# Altium schematic sheet Power.SchDoc: Power
size A4; Organization: Use Organization_Name in ProjParam; Address1: Eliot Ferragni; Address2: STI-MOBOTS; Address3: EPFL; Address4: CH-1015 LAUSANNE; DocumentNumber: 4; Revision: A; SheetNumber: 4; SheetTotal: 7; ApprovedBy: Init ApprovedBy in DocParam; CheckedBy: Init CheckedBy in DocParam; Author: Init Author in DocParam; CompanyName: Init CompanyName in DocParam; DrawnBy: Init DrawBy in DocParam; Engineer: Init Engineer in DocParam; DocumentName: Init DocumentName in DocParam; ProjectName: Init ProjectName in DocParam
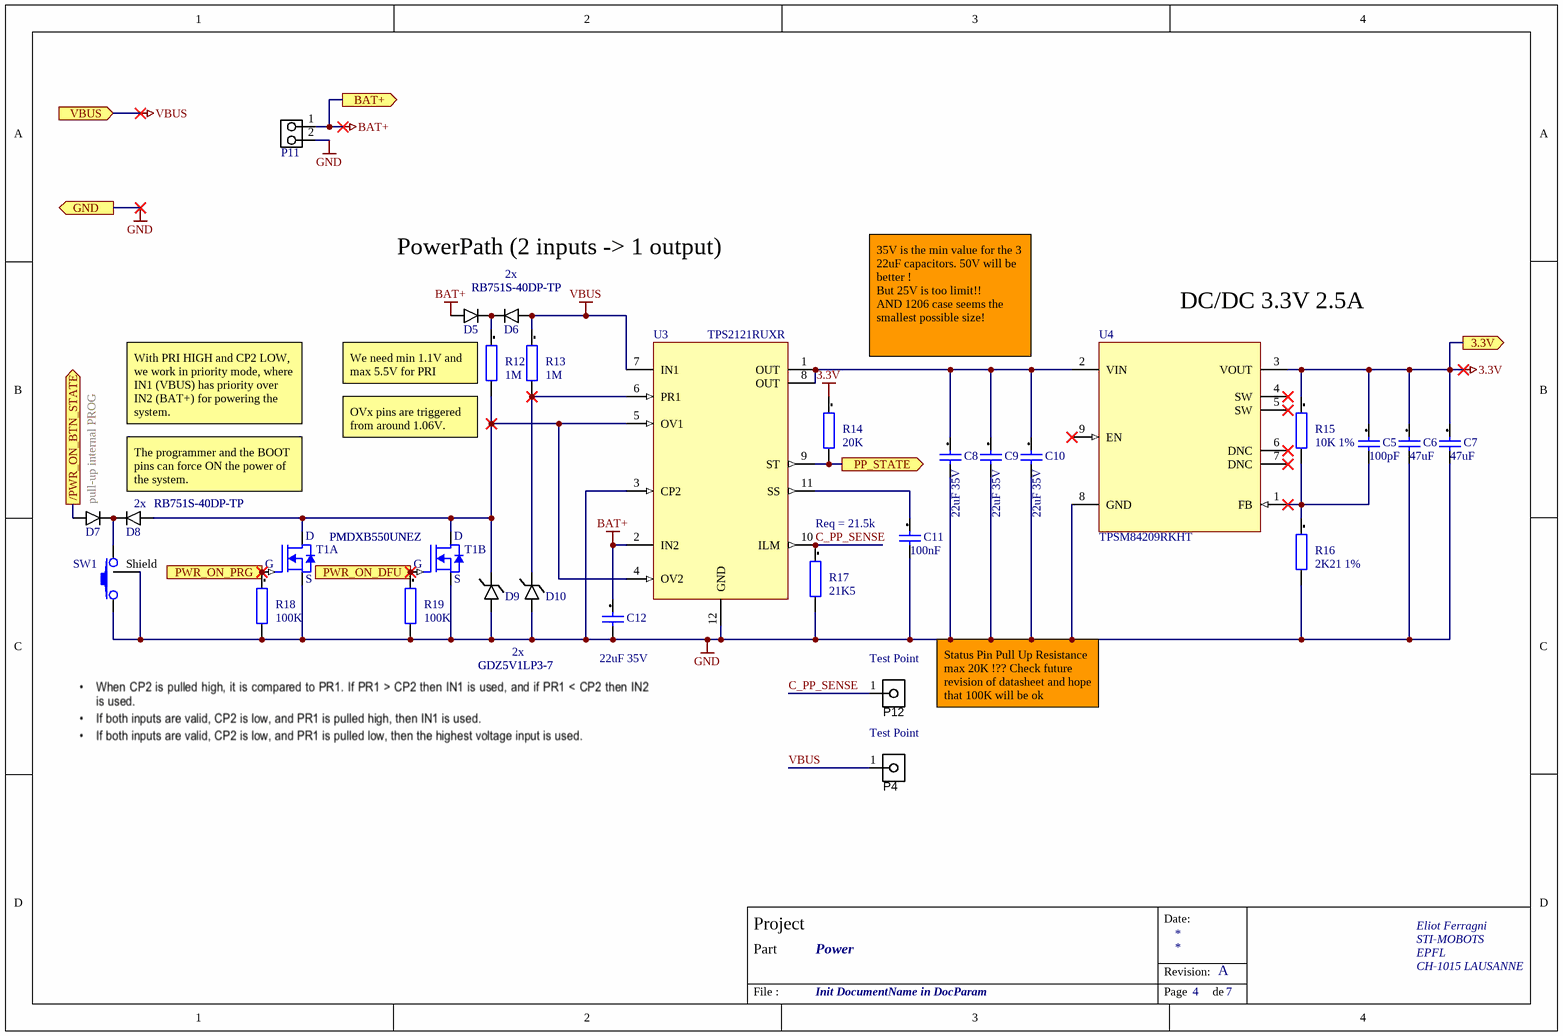
[diagram p0: Power.SchDoc]

## Parts
C5  100pF  [CAPC1608X08L]
C6  47uF  [CAPC1608X08L]
C7  47uF  [CAPC1608X08L]
C8  22uF 35V  [CAPC3216X17L]
C9  22uF 35V  [CAPC3216X17L]
C10  22uF 35V  [CAPC3216X17L]
C11  100nF  [CAPC1608X08L]
C12  22uF 35V  [CAPC3216X17L]
D5  RB751S-40DP-TP  [0201 diode - Wide]
D6  RB751S-40DP-TP  [0201 diode - Wide]
D7  RB751S-40DP-TP  [0201 diode - Wide]
D8  RB751S-40DP-TP  [0201 diode - Wide]
D9  GDZ5V1LP3-7  [0201 diode - Wide]
D10  GDZ5V1LP3-7  [0201 diode - Wide]
P4  Header 1  [HEADER1x1-2.54]  (value not drawn)
P11  2 power pads  [PowerPads 2 pins]  (value not drawn)
P12  Header 1  [HEADER1x1-2.54]  (value not drawn)
R12  1M  [RESC1608X06N]
R13  1M  [RESC1608X06N]
R14  20K  [RESC1608X06N]
R15  10K 1%  [RESC1608X06N]
R16  2K21 1%  [RESC1608X06N]
R17  21K5  [RESC1608X06N]
R18  100K  [RESC1608X06N]
R19  100K  [RESC1608X06N]
SW1  button  [C&K_KMR2]  (value not drawn)
T1  PMDXB550UNEZ  [DFN1010B-6]  (parts A,B of 2)
U3  TPS2121RUXR  [VQFN-HR (RUX) 12]
U4  TPSM84209RKHT  [QFN-FCMOD (RKH) 9]

## Ports
3.3V (out), /PWR_ON_BTN_STATE (out), BAT+ (out), GND (out), PP_STATE (out), PWR_ON_DFU (in), PWR_ON_PRG (in), VBUS (in)

## Nets
3.3V: C5.1 C6.1 C7.1 R14.1 R15.1 U4.3(VOUT) ; port 3.3V
BAT+: C12.1 D5.2(C) P11.1 U3.2(IN2) ; port BAT+
GND: C6.2 C7.2 C8.2 C9.2 C10.2 C11.2 C12.2 D9.2(C) D10.2(C) P11.2 R16.2 R17.2 R18.2 R19.2 SW1.1 SW1.Shield T1.1(S) T1.4(S) U3.3(CP2) U3.12(GND) U4.8(GND) ; port GND
VBUS: D6.2(C) P4.1 R13.1 U3.7(IN1) ; port VBUS
/PWR_ON_BTN_STATE: D7.2(C) ; port /PWR_ON_BTN_STATE
C_PP_SENSE: P12.1 R17.1 U3.10(ILM)
PP_STATE: R14.2 U3.9(ST) ; port PP_STATE
PWR_ON_DFU: R19.1 T1.5(G) ; port PWR_ON_DFU
PWR_ON_PRG: R18.1 T1.2(G) ; port PWR_ON_PRG
NetC5_2: C5.2 R15.2 R16.1 U4.1(FB)
NetC8_1: C8.1 C9.1 C10.1 U3.1(OUT) U3.8(OUT) U4.2(VIN)
NetC11_1: C11.1 U3.11(SS)
NetD5_1: D5.1(C) D6.1(C) R12.1
NetD7_1: D7.1(C) D8.1(C) SW1.2
NetD8_2: D8.2(C) D9.1(C) R12.2 T1.3(D) T1.6(D) U3.4(OV2) U3.5(OV1)
NetD10_1: D10.1(C) R13.2 U3.6(PR1)

Not connected (* = marked no-connect by the designer): U4 4(SW)* 5(SW)* 6(DNC)* 7(DNC)* 9(EN)*

## Notes on the sheet
- PowerPath (2 inputs -> 1 output)
- 2x
- DC/DC 3.3V 2.5A
- (near R12) We need min 1.1V and max 5.5V for PRI
- 35V is the min value for the 3 22uF capacitors. 50V will be better !
  But 25V is too limit!!
  AND 1206 case seems the smallest possible size!
- With PRI HIGH and CP2 LOW, we work in priority mode, where IN1 (VBUS) has priority over IN2 (BAT+) for powering the system.
- (near R12) OVx pins are triggered from around 1.06V.
- (near D7) pull-up internal PROG
- The programmer and the BOOT pins can force ON the power of the system.
- (near D8) 2x
- Req = 21.5k
- (near P12) Test Point
- (near P12) Status Pin Pull Up Resistance max 20K !?? Check future revision of datasheet and hope that 100K will be ok
- Test Point
- Date:
- Project
- Part
- Revision:
- File :
- Page
- de

## Library data of the parts
C5-C7 C11 = TBD Capacitor[[/\]]0603[[/\]]1: Capacitor TBD 0603; Preference: 1; Currentie: CHF; Size: 0603; Footprint Acort: 0603_G; ROHS: True; DateLastUpdate: 2012-11-19 / 14:36:40
C8-C10 C12 = TBD Capacitor[[/\]]1206[[/\]]1: Capacitor TBD 1206; Preference: 1; Currentie: CHF; Size: 1206; Footprint Acort: 1206; ROHS: True; DateLastUpdate: 2012-11-19 / 14:37:26
D5-D8 = RB751S-40DP-TP: Schottky Diodes & Rectifiers 203 Package Schottky Diodes; Manufacturer: MCC; Reverse Voltage (DC): 28V; Average Rectified Current: 30mA; Element Configuration: Single; Forward Current: 200mA; Max Repetitive Reverse Voltage (Vrrm): 40V; Peak Reverse Current: 500nA; Max Power Dissipation: 100mW; Supplier 1: Digi-Key; Manufacturer Part Number: RB751S-40DP-TP; Stock 1: 104704; Pricing 1: 1=0.3, 10=0.27, 100=0.1514, 500=0.08112, 1000=0.05516 (USD); Mount: Surface Mount; Case/Package: 0201; Case Code (Metric): 0603; Case Code (Imperial): 0201; Max Operating Temperature: 125°C; Packaging: Tape and Reel; Termination: SMD/SMT; Max Forward Surge Current (Ifsm): 200mA; Package Quantity: 10000; Max Reverse Voltage (DC): 40V; Length: 0.67mm; Height: 0.34mm; Width: 0.37mm; Supplier Part Number 1: RB751S-40DP-TPMSCT-ND
D9 D10 = GDZ5V1LP3-7: DIODE ZENER 5.1V 250MW 2DFN; Manufacturer: Diodes; Tolerance: 5%; Max Reverse Leakage Current: 200nA; Element Configuration: Single; Supplier 1: Digi-Key; Manufacturer Part Number: GDZ5V1LP3-7; Stock 1: 50190; Pricing 1: 1=0.37, 10=0.303, 100=0.1607, 500=0.1057, 1000=0.07188 (USD); Mount: Surface Mount; Case/Package: DFN; Number of Pins: 2; Min Operating Temperature: -55°C; Max Operating Temperature: 150°C; Packaging: Tape and Reel; Max Power Dissipation: 250mW; Package Quantity: 10000; Zener Voltage: 5.1V; Zener Current: 200nA; Voltage Tolerance: 5%; Peak Reverse Current: 200nA; Power Rating: 250mW; Length: 0.62mm; Height: 0.3mm; Width: 0.32mm; Radiation Hardening: No; REACH SVHC: No SVHC; ComponentLink1URL: https://www.diodes.com/assets/Datasheets/GDZxVxLP3.pdf; ComponentLink1Description: https://www.diodes.com/assets/Datasheets/GDZxVxLP3.pdf; Supplier Part Number 1: GDZ5V1LP3-7DICT-ND
P11 = 2 power pads: 2-Pin; Manufacturer: Generic Components; Class I: Connector; Revision: July-2002: Re-released for DXP Platform.; Publisher: Altium Limited
R12-R19 = TBD[[/\]]0603[[/\]]1: Resistor ToDo 0603; Preference: 1; Currentie: CHF; Size: 0603; Footprint Acort: 0603; ROHS: True; DateLastUpdate: 2012-11-19 / 14:13:33
SW1 = C&K KMR2: KMR221GLFS; Manufacturer: Tyco; Manufacturer Nr: 7-188275-6; Preference: 1; Currentie: CHF; Quant_1: 10; Quant_2: 900; Circuit: SPST-NO; Switch Function: Off-Mom; Contact Rating @ Voltage: 0.05A @ 32VDC; Actuator Type: Standard; Actuator Height off PCB, from Pins: 1.90mm; Actuator Orientation: Top Actuated; Outline: 4.60mm x 2.80mm; Illumination: Non-Illuminated; Operating Force: 200gf; Switch Travel: 0.25mm; Mechanical Life: 200,000 Cycles; Footprint Acort: ToDefine; ComponentLink1Description: Datasheet; ComponentLink1URL: http://ecommas.tycoelectronics.com/commerce/DocumentDelivery/DDEController?Action=showdoc&DocId=Customer+Drawing%7F188275%7FR%7Fpdf%7FEnglish%7FC_188275_R.pdf; Supplier: Farnell; Supplier Nr: 1056234; ComponentLink2Description: Farnell link; ComponentLink2URL: http://fr.farnell.com/jsp/displayProduct.jsp?sku=1056234; ROHS: True; Type: SMD; Orientation: Vertical; DateLastUpdate: 2007-12-04 / 09:15:57; Price_1: 1,1; Price_2: 0,924; Supplier 1: Digi-Key; Manufacturer Part Number: KMR221GLFS; Category: Switches; Stock 1: 20549; Pricing 1: 1=0.51, 10=0.493, 25=0.484, 50=0.4656, 100=0.4017, 250=0.3652, 500=0.34694, 1000=0.2739 (USD); Packaging: Cut Tape (CT); Mounting Type: Surface Mount; Termination Style: Gull Wing; Illumination Voltage (Nominal): -; Illumination Type, Color: -; Ingress Protection: -; Features: Grounding Pin; Actuator Material: -; Operating Temperature: -40°C ~ 85°C; ComponentLink3URL: http://www.ck-components.com/index.php?module=media&action=Display&cmpref=14414&lang=en&width=&height=&format=&alt=; ComponentLink3Description: http://www.ck-components.com/index.php?module=media&action=Display&cmpref=14414&lang=en&width=&height=&format=&alt=; Supplier Part Number 1: 401-1427-1-ND
T1 = PMDXB550UNEZ: DUAL N-CHANNEL 30V; Manufacturer: NXP Semiconductors; Continuous Drain Current (ID): 590mA; Max Power Dissipation: 285mW; Rds On Max: 670mR; Input Capacitance: 30.3pF; FET Type: 2 N-Channel; Supplier 1: Digi-Key; Stock 1: 5582; Pricing 1: 1=0.48, 10=0.379, 100=0.2601, 500=0.17838, 1000=0.13379 (USD); Mount: Surface Mount; Min Operating Temperature: -55°C; Max Operating Temperature: 150°C; Drain to Source Voltage (Vdss): 30V; Packaging: Tape and Reel; Supplier Part Number 1: 1727-2277-1-ND; Manufacturer Part Number: PMDXB550UNEZ
U3 = TPS2121RUXR: Power Mux Dual Input One Output; Manufacturer: Texas Instruments; PartNumber: TPS2121RUXR; RefDes: RefDes; Type: DEV; Value: Value
U4 = TPSM84209RKHT: DC DC CONVERTER 1.2-6V 15W; Manufacturer: Texas Instruments; Voltage - Input (Min): 4.5V; Voltage - Input (Max): 28V; Voltage - Output 1: 1.2 ~ 6 V; Current - Output (Max): 2.5A; Efficiency: 86.5%; Supplier 1: Digi-Key; Manufacturer Part Number: TPSM84209RKHT; RoHS: Request Inventory Verification; Category: Power Supplies - Board Mount; Stock 1: 47; Pricing 1: 1=5.04, 10=4.53, 100=3.7117 (USD); Packaging: Cut Tape (CT); Part Status: Active; Type: Non-Isolated PoL Module; Voltage - Output 2: -; Voltage - Output 3: -; Voltage - Output 4: -; Applications: ITE (Commercial); Features: OCP, OTP, UVLO; Operating Temperature: -40°C ~ 85°C (With Derating); Mounting Type: Surface Mount; Package / Case: 9-PowerQFN; Size / Dimension: 0.18" L x 0.16" W x 0.08" H (4.5mm x 4.0mm x 2.1mm); Supplier Device Package: 9-QFN-FCMOD (4.5x4); ComponentLink1URL: http://www.ti.com/lit/ds/symlink/tpsm84209.pdf; ComponentLink1Description: http://www.ti.com/lit/ds/symlink/tpsm84209.pdf
P4 P12 = Header 1: LatestRevisionDate: 17-Jul-2002; LatestRevisionNote: Re-released for DXP Platform.; Publisher: Altium Limited